# EAGLE schematic 6foot (EAGLE 9.6.1)
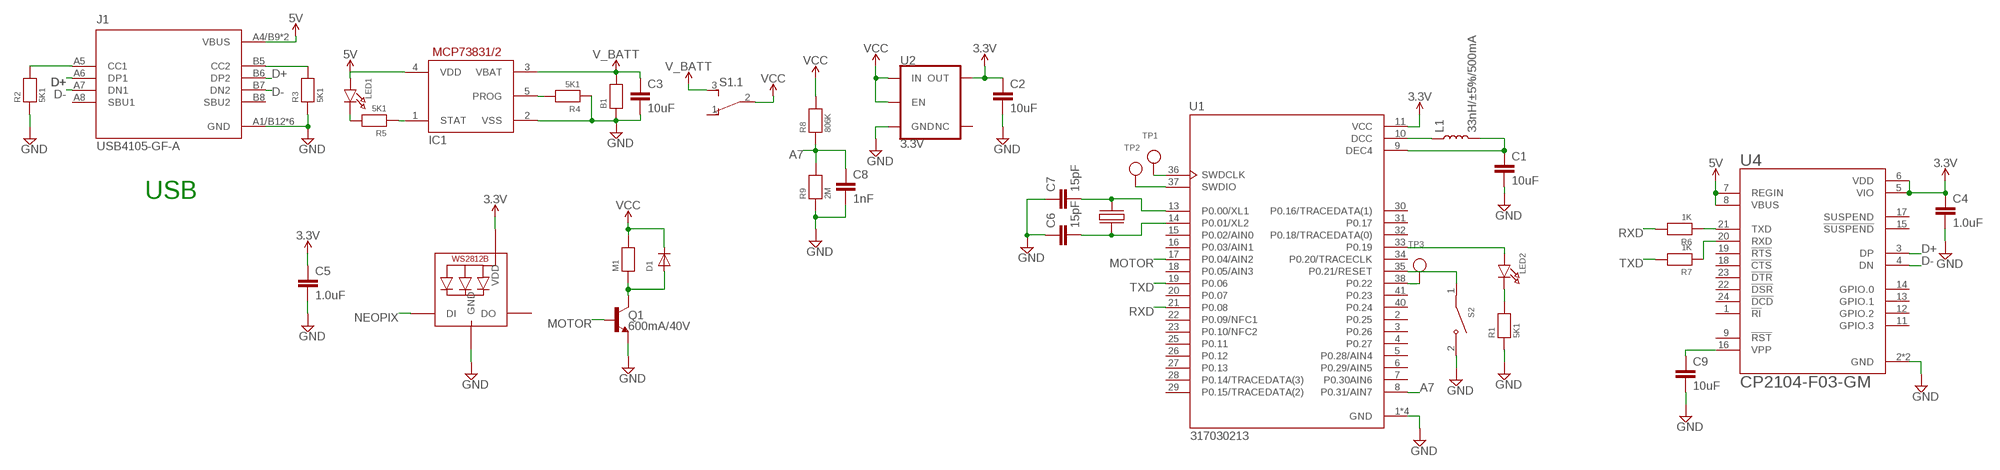
[diagram p0: schematic, sheet 1]

## Parts
B1  RESISTOR1206  [1206]
C1  10uF  10UF-1206-6.3V-20%  [1206]
C2  10uF  10UF-1206-6.3V-20%  [1206]
C3  10uF  10UF-1206-6.3V-20%  [1206]
C4  1.0uF  1.0UF-0603-16V-10%  [0603]
C5  1.0uF  1.0UF-0603-16V-10%  [0603]
C6  15pF  15PF-0603-50V-5%  [0603]
C7  15pF  15PF-0603-50V-5%  [0603]
C8  1nF  15PF-0603-50V-5%  [0603]
C9  10uF  10UF-1206-6.3V-20%  [1206]
D1  DIODESOD-323F  [SOD-323F]
IC1  MCP73831/OT  [SOT23-5L]
J1  USB4105-GF-A  [GCT_USB4105-GF-A]
L1  33nH/±5%/500mA  INDUCTOR-0603-33NH  [0603]
LED1  LED0603  [CHIPLED_0603]
LED2  LED0603  [CHIPLED_0603]
LED3  WS2812B5050  [WS2812B]
M1  RESISTOR1206  [1206]
Q1  600mA/40V  TRANS_NPN-MMBT2222AL  [SOT23-3]
R1  5K1  RESISTOR0603  [0603]
R2  5K1  RESISTOR0603  [0603]
R3  5K1  RESISTOR0603  [0603]
R4  5K1  RESISTOR0603  [0603]
R5  5K1  RESISTOR0603  [0603]
R6  1K  RESISTOR0603  [0603]
R7  1K  RESISTOR0603  [0603]
R8  806K  RESISTOR0603  [0603]
R9  2M  RESISTOR0603  [0603]
S1  JS202011JCQN  [JS202011JCQN]
S2  PTS636_SM43J_SMTR_LFS  [SW_PTS636_SM43J_SMTR_LFS]
TP1  TESTPOINTROUND2MM  [TESTPOINT_ROUND_2MM]
TP2  TESTPOINTROUND2MM  [TESTPOINT_ROUND_2MM]
TP3  TESTPOINTROUND2MM  [TESTPOINT_ROUND_2MM]
U1  317030213  [XCVR_317030213]
U2  3.3V  V_REG_AP2112K-3.3V  [SOT23-5]
U4  CP2104-F03-GM  [QFN50P400X400X80-25N]
U$1  XTAL_32KHZ  [XTAL_32KHZ]

## Nets
3.3V: C2.1 C4.1 C5.1 LED3.1-VDD(VDD) U1.11(VCC) U2.5(OUT) U4.5(VIO) U4.6(VDD)
5V: J1.A4/B9(VBUS) J1.B4/A9(VBUS) U4.7(REGIN) U4.8(VBUS)
A7: C8.1 R8.1 R9.2 U1.8(P0.31/AIN7)
D+: J1.A6(DP1) J1.B6(DP2) U4.3(DP)
D-: J1.A7(DN1) J1.B7(DN2) U4.4(DN)
GND: B1.1 C1.2 C2.2 C3.2 C4.2 C5.2 C6.1 C7.1 C8.2 C9.2 IC1.2(VSS) J1.A1/B12(GND) J1.B1/A12(GND) J1.G1(GND) J1.G2(GND) J1.G3(GND) J1.G4(GND) LED3.3-GND(GND) Q1.2(E) R1.1 R2.1 R3.1 R4.1 R9.1 S2.2(NO) U1.1(GND) U1.12(GND) U1.24(GND) U1.39(GND) U2.2(GND) U4.2(GND) U4.25(GND)
MOTOR: Q1.1(B) U1.17(P0.04/AIN2)
N$1: C7.2 U1.13(P0.00/XL1) U$1.P$2
N$2: C6.2 U1.14(P0.01/XL2) U$1.P$1
N$3: J1.A5(CC1) R2.2
N$4: L1.1 U1.10(DCC)
N$5: C1.1 L1.2 U1.9(DEC4)
N$6: J1.B5(CC2) R3.2
N$7: IC1.5(PROG) R4.2
N$8: D1.A M1.1 Q1.3(C)
N$9: LED2.A U1.33(P0.19)
N$10: IC1.1(STAT) R5.1
N$11: LED1.C R5.2
N$12: IC1.4(VDD) LED1.A ; supply symbol labelled 5V
N$13: LED2.C R1.2
N$14: C9.1 U4.16(VPP)
N$15: R6.1 U4.21(TXD)
N$16: S2.1(COM) U1.35(P0.21/RESET)
N$18: TP3.P$1 U1.38(P0.22)
N$19: TP1.P$1 U1.36(SWDCLK)
N$20: TP2.P$1 U1.37(SWDIO)
NEOPIX: LED3.4-DIN(DI)
RXD: R6.2 U1.21(P0.08)
TXD: R7.1 R7.2 U1.19(P0.06) U4.20(RXD)
V_BATT: B1.2 C3.1 IC1.3(VBAT) S1.3(.1:S)
VCC: D1.C M1.2 R8.2 S1.2(.1:P) U2.1(IN) U2.3(EN)
Unconnected: J1.A8(SBU1) J1.B8(SBU2) LED3.2-DOUT(DO) S1.1(.1:O) S1.4(.2:O) S1.5(.2:P) S1.6(.2:S) U1.2(P0.25) U1.3(P0.26) U1.4(P0.27) U1.5(P0.28/AIN4) U1.6(P0.29/AIN5) U1.7(P0.30AIN6) U1.15(P0.02/AIN0) U1.16(P0.03/AIN1) U1.18(P0.05/AIN3) U1.20(P0.07) U1.22(P0.09/NFC1) U1.23(P0.10/NFC2) U1.25(P0.11) U1.26(P0.12) U1.27(P0.13) U1.28(P0.14/TRACEDATA(3)) U1.29(P0.15/TRACEDATA(2)) U1.30(P0.16/TRACEDATA(1)) U1.31(P0.17) U1.32(P0.18/TRACEDATA(0)) U1.34(P0.20/TRACECLK) U1.40(P0.24) U1.41(P0.23) U2.4(NC) U4.1(!RI) U4.9(!RST!) U4.11(GPIO.3) U4.12(GPIO.2) U4.13(GPIO.1) U4.14(GPIO.0) U4.15(!SUSPEND!) U4.17(SUSPEND) U4.18(!CTS) U4.19(!RTS) U4.22(!DSR) U4.23(!DTR) U4.24(!DCD)

## Notes on the sheet
- USB

## Library data of the parts
B1 M1 = tinkrmind_custom:RESISTOR: Resistors 0402 - 0402 Surface Mount Package 22 Ohm 1% 1/16W [Digikey: 311-22.0LRTR-ND] 33 Ohm 5% 1/16W 1.0K 5% 1/16W 1.5K 5% 1/16W 2.0K 1% 1/16W 10.0K 1% 1/16W [Digikey: 311-10.0KLRTR-ND] 10.0K 5% 1/16W [Digikey: RMCF0402JT10K0TR-ND] 12.1K 1% 1/16W [Digikey: 311-22.0LRTR-ND] 100.0K 5% 1/16W 0603 - 0603 Surface Mount Package 0 Ohm 1/10 Watt 1% Resistor 15 Ohm 1/10 Watt 1% Resistor 33 Ohm 1/10 Watt 1% Resistor 49.9 Ohm 1/10 Watt 1% Resistor 100 Ohm 1/10 Watt 1% Resistor 150 Ohm 1/10 Watt 1% Resistor 240 Ohm 1/10 Watt 1% Resistor 390 Ohm 1/10 Watt 1% Resistor 560 Ohm 1/10 Watt 1% Resistor 680 Ohm 1/10 Watt 1% Resistor 750 Ohm 1/10 Watt 1% Resistor 1.0K Ohm 1/10 Watt 1% Resistor 1.5K Ohm 1/10 Watt 1% Resistor 2.0K Ohm 1/10 Watt 1% Resistor 2.2K Ohm 1/10 Watt 1% Resistor 3.3K Ohm 1/10 Watt 1% Resistor 4.7K Ohm 1/10 Watt 1% Resistor 10.0K Ohm 1/10 Watt 1% Resistor 12.0K Ohm 1/10 Watt 1% Resistor 12.1K Ohm 1/10 Watt 1% Resistor 20.0K Ohm 1/10 Watt 1% Resistor 33.0K Ohm 1/10 Watt 1% Resistor 100.0K Ohm 1/10 Watt 1% Resistor 0805 - 0805 Surface Mount Package 0 Ohm 1/8 Watt 1% Resistor 33 Ohm 1/8 Watt 1% Resistor 100 Ohm 1/8 Watt 1% Resistor 150 Ohm 1/8 Watt 1% Resistor 200 Ohm 1/8 Watt 1% Resistor 240 Ohm 1/8 Watt 1% Resistor 330 Ohm 1/8 Watt 1% Resistor 390 Ohm 1/8 Watt 1% Resistor 470 Ohm 1/8 Watt 1% Resistor 1.0K Ohm 1/8 Watt 1% Resistor 1.5K Ohm 1/8 Watt 1% Resistor 2.0K Ohm 1/8 Watt 1% Resistor 4.7K Ohm 1/8 Watt 1% Resistor 5.1K Ohm 1/8 Watt 1% Resistor 5.6K Ohm 1/8 Watt 1% Resistor 10.0K Ohm 1/8 Watt 1% Resistor 22.0K Ohm 1/8 Watt 1% Resistor 33.0K Ohm 1/8 Watt 1% Resistor 100K Ohm 1/8 Watt 1% Resistor 1206 - 1206 Surface Mount Package 2012 - 2010 Surface Mount Package 0.11 Ohm 1/2 Watt 1% Resistor - Digikey: RHM.11UCT-ND
C1-C3 C9 = SparkFun-Capacitors:10UF: 10.0µF ceramic capacitors A capacitor is a passive two-terminal electrical component used to store electrical energy temporarily in an electric field.; PROD_ID: CAP-10057
C4 C5 = SparkFun-Capacitors:1.0UF: 1µF ceramic capacitors A capacitor is a passive two-terminal electrical component used to store electrical energy temporarily in an electric field.; PROD_ID: CAP-00868
C6 C7 = SparkFun-Capacitors:15PF: 15pF ceramic capacitors A capacitor is a passive two-terminal electrical component used to store electrical energy temporarily in an electric field.; PROD_ID: CAP-07881
C8 = SparkFun-Capacitors:15PF: 15pF ceramic capacitors A capacitor is a passive two-terminal electrical component used to store electrical energy temporarily in an electric field.; PROD_ID: CAP-07881; VALUE: 15pF
D1 = adafruit:DIODE: Diode SMADIODE - SMA Surface Mount Package 20V 1A Schottky Diode Digikey: 641-1014-6-ND DO-1N4148 - Through Hole Small Current Diode SOD-123 20V 1 A (.5mV Vf) Schottky Diode - Digikey: MBRX120TPMSCT-ND SOD-323 10V 570mA (.38mV Vf, 3ns) Schottky Diode - Digikey: ZLLS410CT-ND SOD-523 30V 30mA Schottky Diode (RB751S-40TE61) - Digikey: RB751S-40TE61CT-ND SOT23-R/W - SOT23 Package (R = Solder Paste/Reflow Ovens, W = Hand-Soldering) BAT54Film 40V 300mA - Digikey: 497-7162-1-ND
IC1 = adafruit:MCP73831: MCP73831/2 Miniature Single-Cell, Fully Integrated Li-Ion, Li-Polymer Charge Management Controllers. Nice and small simple lipoly charge controller, with adjustable current and status output (LED) http://www.ladyada.net/library/pcb/eaglelibrary.html
J1 = USB4105-GF-A:USB4105-GF-A: USB Type C Receptacle for USB 2.0 SMT Type, PCB Top Mount; DESCRIPTION: USB-C _USB TYPE-C_ USB 2.0 Receptacle Connector 24 _16+8 Dummy_ Position Surface Mount, Right Angle; Through Hole; DIGI-KEY_PART_NUMBER: 2073-USB4105-GF-ACT-ND; DIGI-KEY_PURCHASE_URL: https://www.digikey.com/product-detail/en/gct/USB4105-GF-A/2073-USB4105-GF-ACT-ND/11198510?utm_source=snapeda&utm_medium=aggregator&utm_campaign=symbol; MF: GCT; MP: USB4105-GF-A; PACKAGE: None
L1 = SparkFun-Coils:INDUCTOR: Inductors Resist changes in electrical current. Basically a coil of wire. SparkFun Products: SparkFun Load Cell Amplifier - HX711 <https://www.sparkfun.com/products/13879> IOIO-OTG - V2.2 <https://www.sparkfun.com/products/13613>; PROD_ID: NDUC-07874
LED1 LED2 = microbuilder:LED: LED 0603 - 0603 Surface Mount Package 2mA: Green LED - Low Power (3.9mcd, 2ma, 1.7Vf) - Digikey: 475-2709-2-ND Orange LED - Low Power (9.8mcd, 2ma, 1.8Vf) - Digikey: 475-1194-2-ND Red LED - Low Power (5mcd, 2ma, 1.8Vf) - Digikey: 475-1195-2-ND Yellow LED - Low Power (7mcd, 2ma, 1.8Vf) - Digikey: 475-1196-2-ND 5mA: Blue LED - Low Power (17mcd, 5ma, 2.9Vf) - Digikey: LNJ937W8CRACT-ND 0805 - 0805 Surface Mount Package 2mA: Red LED (8.8mcd, 2mA, 1.8Vf, Clear) - Low Power [Digikey: 475-2510-1-ND] Green LED (5mcd, 2mA, 1.8Vf, Clear) - Low Power [Digikey: 475-2730-1-ND] Yellow LED (11.3mcd, 2mA, 1.8Vf, Clear) - Low Power [Digikey: 475-2555-1-ND] 20mA: Red LED (104mcd, 20mA, Diffused) - LS R976 [Digikey: 475-1278-6-ND] Red LED (12mcd, 20mA, 2.0Vf, Clear) - APT2012EC [Digikey: 754-1128-1-ND] Green LED (15mcd, 20mA, 2.2Vf, Clear) - APT2012GC [Digikey: 754-1131-1-ND] Orange LED (160mcd, 20mA, 2.1Vf, Clear) - APT2012SECK [Digikey: 754-1130-1-ND] 1206 - 1206 Surface Mount Package Green LED (26mcd, 20mA, Diffused) - LG N971 [Digikey: 475-1407-6-ND] Red LED (15mcd, 20mA, Diffused) - LH N974 [Digikey: 475-1416-6-ND]
LED3 = adafruit:WS2812B
Q1 = SparkFun-DiscreteSemi:TRANS_NPN: NPN transistor Current controlled devices typically used to amplify current or used as a switch. BC547 - COM-08928 <http://www.sparkfun.com/products/8928> (TO-92 45V 100mA) (1.Collector 2.Base 3.Emitter) 2N3904 - COM-00521 <http://www.sparkfun.com/products/521> (TO-92 40V 200mA) (1.Emitter 2.Base 3.Collector) P2N2222A - COM-12852 <http://www.sparkfun.com/products/12852> (TO-92 40V 600mA) (1.Collector 2.Base 3.Emitter); PROD_ID: TRANS-08049
R1-R9 = microbuilder:RESISTOR: Resistors 0402 - 0402 Surface Mount Package 22 Ohm 1% 1/16W [Digikey: 311-22.0LRTR-ND] 33 Ohm 5% 1/16W 1.0K 5% 1/16W 1.5K 5% 1/16W 2.0K 1% 1/16W 10.0K 1% 1/16W [Digikey: 311-10.0KLRTR-ND] 10.0K 5% 1/16W [Digikey: RMCF0402JT10K0TR-ND] 12.1K 1% 1/16W [Digikey: 311-22.0LRTR-ND] 100.0K 5% 1/16W 0603 - 0603 Surface Mount Package 0 Ohm 1/10 Watt 1% Resistor 15 Ohm 1/10 Watt 1% Resistor 33 Ohm 1/10 Watt 1% Resistor 49.9 Ohm 1/10 Watt 1% Resistor 100 Ohm 1/10 Watt 1% Resistor 150 Ohm 1/10 Watt 1% Resistor 240 Ohm 1/10 Watt 1% Resistor 390 Ohm 1/10 Watt 1% Resistor 560 Ohm 1/10 Watt 1% Resistor 680 Ohm 1/10 Watt 1% Resistor 750 Ohm 1/10 Watt 1% Resistor 1.0K Ohm 1/10 Watt 1% Resistor 1.5K Ohm 1/10 Watt 1% Resistor 2.0K Ohm 1/10 Watt 1% Resistor 2.2K Ohm 1/10 Watt 1% Resistor 3.3K Ohm 1/10 Watt 1% Resistor 4.7K Ohm 1/10 Watt 1% Resistor 10.0K Ohm 1/10 Watt 1% Resistor 12.0K Ohm 1/10 Watt 1% Resistor 12.1K Ohm 1/10 Watt 1% Resistor 20.0K Ohm 1/10 Watt 1% Resistor 33.0K Ohm 1/10 Watt 1% Resistor 100.0K Ohm 1/10 Watt 1% Resistor 0805 - 0805 Surface Mount Package 0 Ohm 1/8 Watt 1% Resistor 33 Ohm 1/8 Watt 1% Resistor 100 Ohm 1/8 Watt 1% Resistor 150 Ohm 1/8 Watt 1% Resistor 200 Ohm 1/8 Watt 1% Resistor 240 Ohm 1/8 Watt 1% Resistor 330 Ohm 1/8 Watt 1% Resistor 390 Ohm 1/8 Watt 1% Resistor 470 Ohm 1/8 Watt 1% Resistor 1.0K Ohm 1/8 Watt 1% Resistor 1.5K Ohm 1/8 Watt 1% Resistor 2.0K Ohm 1/8 Watt 1% Resistor 4.7K Ohm 1/8 Watt 1% Resistor 5.1K Ohm 1/8 Watt 1% Resistor 5.6K Ohm 1/8 Watt 1% Resistor 10.0K Ohm 1/8 Watt 1% Resistor 22.0K Ohm 1/8 Watt 1% Resistor 33.0K Ohm 1/8 Watt 1% Resistor 100K Ohm 1/8 Watt 1% Resistor 1206 - 1206 Surface Mount Package 2012 - 2010 Surface Mount Package 0.11 Ohm 1/2 Watt 1% Resistor - Digikey: RHM.11UCT-ND
S1 = JS202011JCQN:JS202011JCQN; AVAILABILITY: Unavailable; DESCRIPTION: Slide Switch DPDT Surface Mount; MF: C&K; MP: JS202011JCQN; PACKAGE: None; PRICE: None
S2 = PTS636_SM43J_SMTR_LFS:PTS636_SM43J_SMTR_LFS: Tactile Switch SPST-NO Top Actuated Surface Mount; AVAILABILITY: Unavailable; DESCRIPTION: Tactile Switch SPST-NO Top Actuated Surface Mount; MF: C&K; MP: PTS636 SM43J SMTR LFS; PACKAGE: None; PRICE: None
TP1-TP3 = microbuilder:TESTPOINT: Test Point Various test points for characterisation and PCB testing TESTPOINT_SMT - Compact Surface Mount Test Point [Digikey: 5016KTR-ND]
U1 = 317030213:317030213: Mdbt42q Nrf52832 Based BLE Module; AVAILABILITY: Unavailable; DESCRIPTION: Bluetooth Bluetooth v4.2 Transceiver Module 2.4GHz Integrated, Chip Surface Mount; MF: Seeed Technology; MP: 317030213; PACKAGE: SMD-41 Seeed Studio; PRICE: None
U2 = SparkFun-IC-Power:V_REG_AP2112: AP2112 - 600mA CMOS LDO Regulator w/ Enable The AP2112 is CMOS process low dropout linear regulator with enable function, the regulator delivers a guaranteed 600mA (min.) continuous load current. Features Output Voltage Accuracy: ±1.5% Output Current: 600mA (Min.) Foldback Short Current Protection: 50mA Enable Function to Turn ON/OFF VOUT Low Dropout Voltage (3.3V): 250mV (Typ.) @IOUT=600mA Excellent Load Regulation: 0.2%/A (Typ.) Excellent Line Regulation: 0.02%/V (Typ.) Low Quiescent Current: 55μA (Typ.) Low Standby Current: 0.01μA (Typ.) Low Output Noise: 50μVRMS PSRR: 100Hz -65dB, 1kHz -65dB OTSD Protection Stable with 1.0μF Flexible Cap: Ceramic, Tantalum and Aluminum Electrolytic Operation Temperature Range: -40°C to 85°C ESD: MM 400V, HBM 4000V; PROD_ID: VREG-12457
U4 = CP2104:CP2104: Silabs CP2104 USB to UART Bridge; AVAILABILITY: Unavailable; DESCRIPTION: USB Bridge, USB to UART USB 2.0 UART Interface 24-QFN _4x4_; MF: Silicon Labs; MP: CP2104; PACKAGE: QFN-24 Silicon Labs; PRICE: None
U$1 = tinkrmind_custom:XTAL_32KHZ: https://www.digikey.com/product-detail/en/FC-135+32.7680KA-A/FC-13532.7680KA-A-ND/7727568/?itemSeq=322162767